# EAGLE schematic arduinoISP (EAGLE 9.1.2)
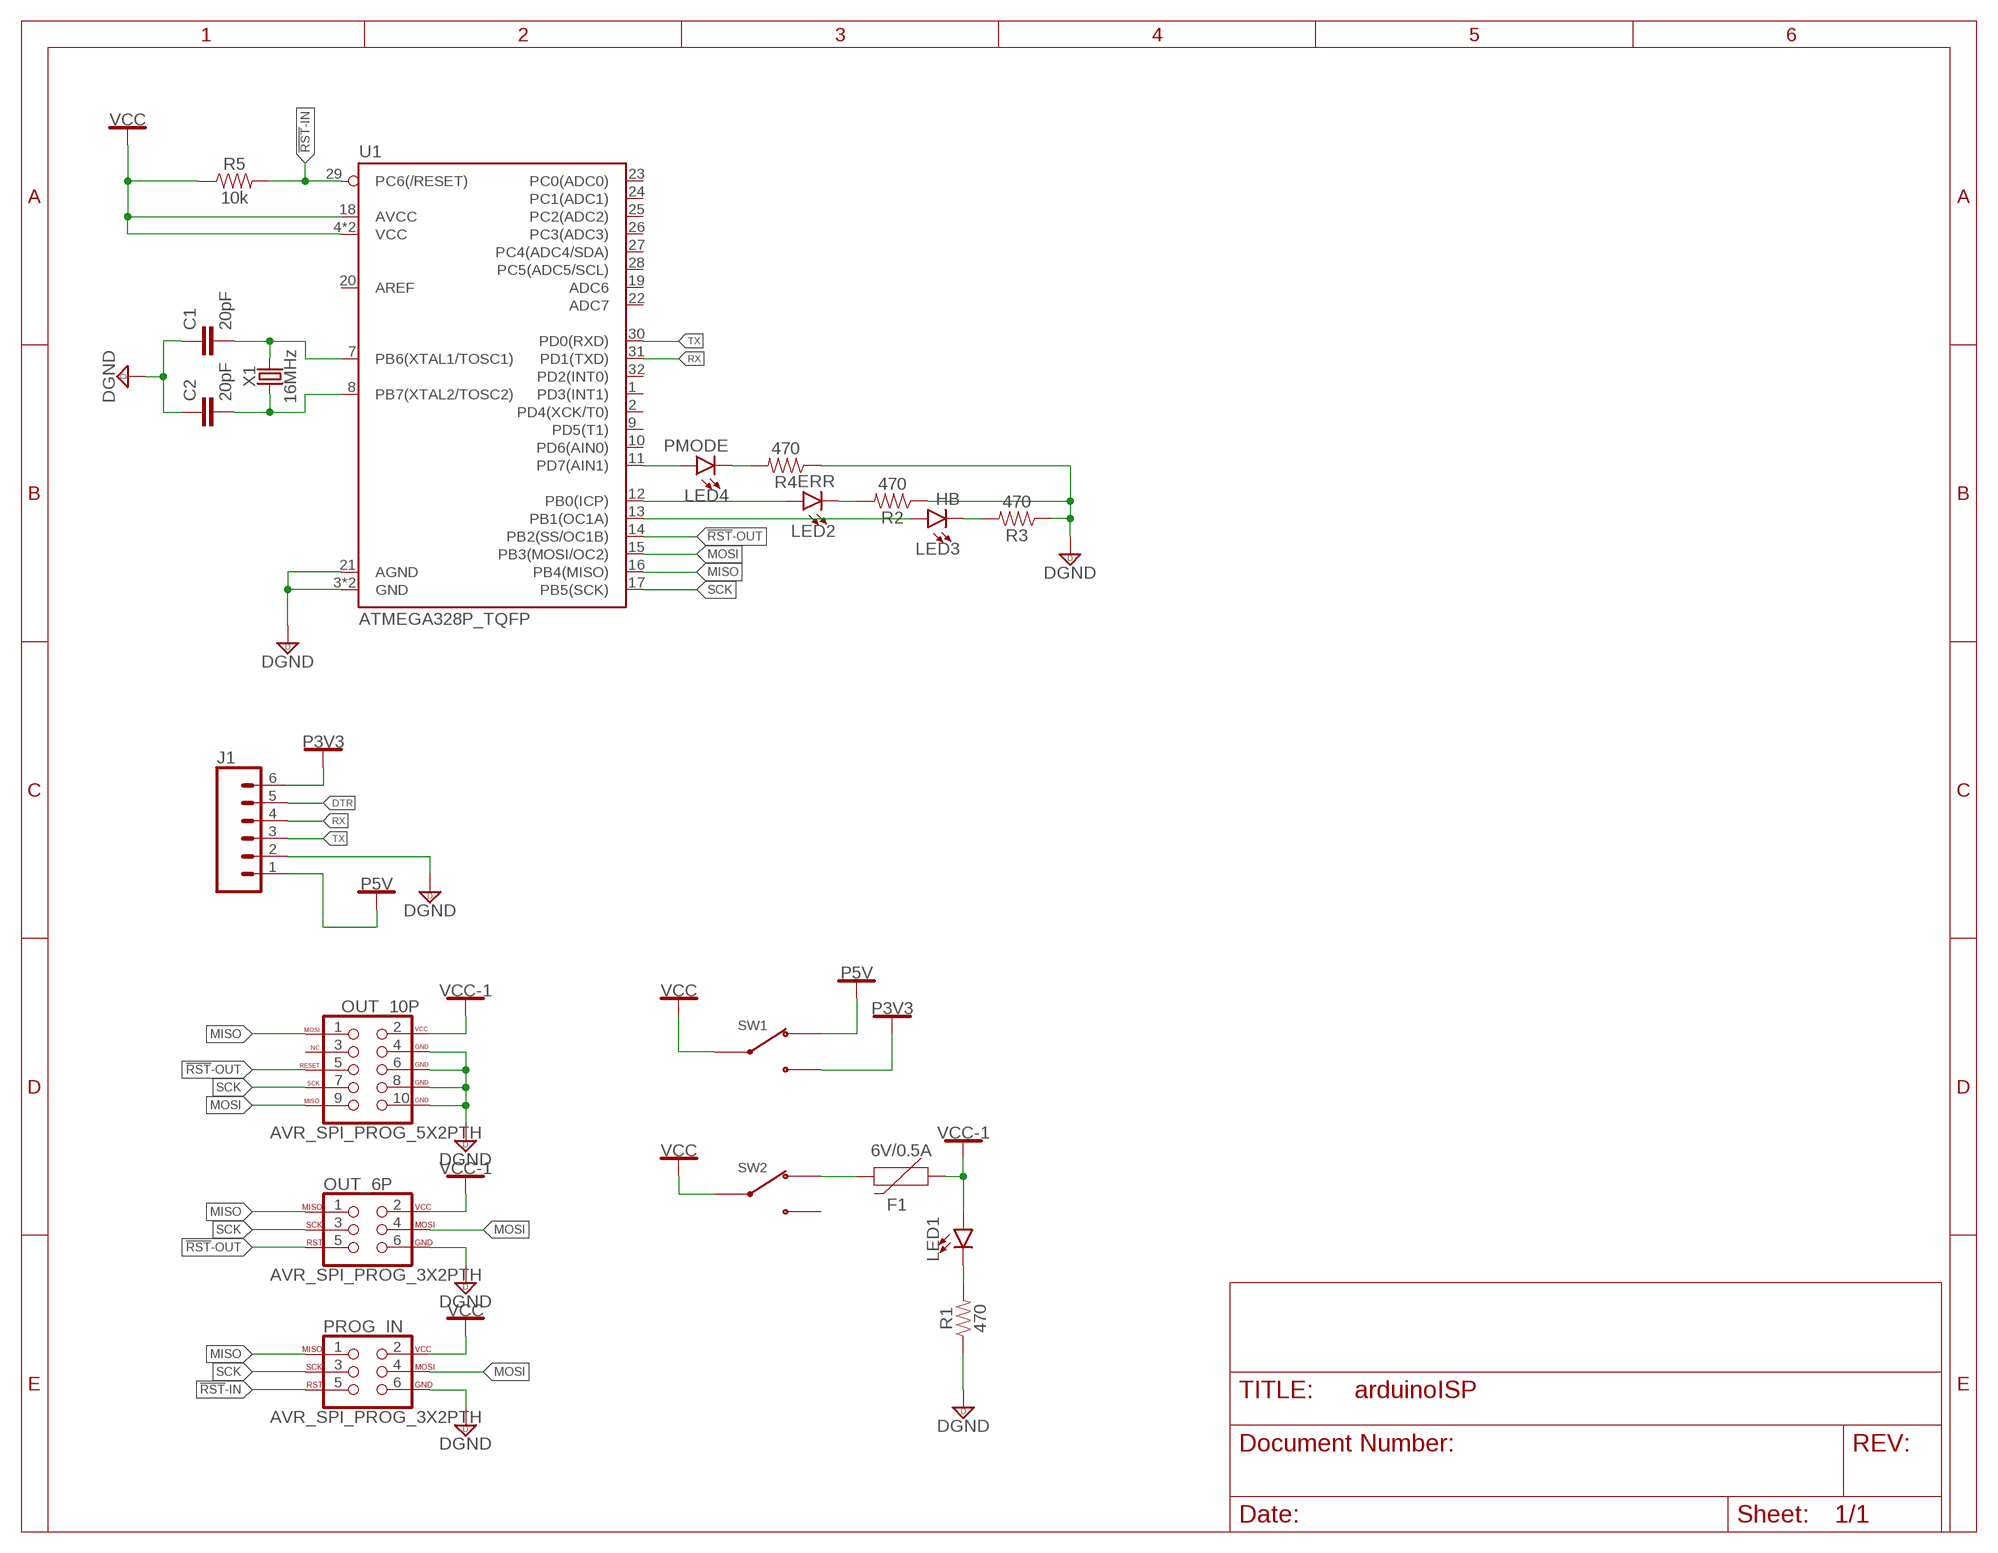
[diagram p0: schematic, sheet 1]

## Parts
C1  20pF  CAPACITOR_SMT_0603  [0603]
C2  20pF  CAPACITOR_SMT_0603  [0603]
F1  6V/0.5A  PPTC_HALF-AMP  [1206]
J1  CONN_06NO_SILK_NO_POP  [1X06_NO_SILK]
LED1  LED3MM  [LED_3MM]
LED2  ERR  LED3MM  [LED_3MM]
LED3  HB  LED3MM  [LED_3MM]
LED4  PMODE  LED3MM  [LED_3MM]
OUT_6P  AVR_SPI_PROG_3X2PTH  [2X3]
OUT_10P  AVR_SPI_PROG_5X2PTH  [2X5]
PROG_IN  AVR_SPI_PROG_3X2PTH  [2X3]
R1  470  RESISTOR_SMT_0603  [0603]
R2  470  RESISTOR_SMT_0603  [0603]
R3  470  RESISTOR_SMT_0603  [0603]
R4  470  RESISTOR_SMT_0603  [0603]
R5  10k  RESISTOR_SMT_0603  [0603]
SW1  SW-SPDT_SS-12D02-VG4  [SW_SS-12D10L5_FP]
SW2  SW-SPDT_SS-12D02-VG4  [SW_SS-12D10L5_FP]
U1  ATMEGA328P_TQFP  [TQFP32-08]
X1  16MHz  CRYSTAL-16MHZPTH-HC49US  [HC49US]

## Nets
!RST!-IN: PROG_IN.5 R5.2 U1.29(PC6(/RESET))
!RST!-OUT: OUT_6P.5 OUT_10P.5(RESET) U1.14(PB2(SS/OC1B))
DGND: C1.1 C2.1 J1.2 OUT_6P.6 OUT_10P.4(GND) OUT_10P.6(GND) OUT_10P.8(GND) OUT_10P.10(GND) PROG_IN.6 R1.1 R2.1 R3.1 R4.1 U1.3(GND) U1.5(GND) U1.21(AGND)
DTR: J1.5
MISO: OUT_6P.1 OUT_10P.1(MOSI) PROG_IN.1 U1.16(PB4(MISO))
MOSI: OUT_6P.4 OUT_10P.9(MISO) PROG_IN.4 U1.15(PB3(MOSI/OC2))
N$1: LED1.K(C) R1.2
N$2: LED2.K(C) R2.2
N$3: LED2.A U1.12(PB0(ICP))
N$4: LED3.K(C) R3.2
N$5: LED4.K(C) R4.2
N$6: LED3.A U1.13(PB1(OC1A))
N$7: LED4.A U1.11(PD7(AIN1))
N$8: C1.2 U1.7(PB6(XTAL1/TOSC1)) X1.2
N$9: C2.2 U1.8(PB7(XTAL2/TOSC2)) X1.1
N$10: F1.2 SW2.P$1(A)
P3V3: J1.6 SW1.P$3(B)
P5V: J1.1 SW1.P$1(A)
RX: J1.4 U1.31(PD1(TXD))
SCK: OUT_6P.3 OUT_10P.7(SCK) PROG_IN.3 U1.17(PB5(SCK))
TX: J1.3 U1.30(PD0(RXD))
VCC: PROG_IN.2 R5.1 SW1.P$2(COM) SW2.P$2(COM) U1.4(VCC) U1.6(VCC) U1.18(AVCC)
VCC1: F1.1 LED1.A OUT_6P.2 OUT_10P.2(VCC) ; supply symbol labelled VCC-1
Unconnected: OUT_10P.3(NC) SW2.P$3(B) U1.1(PD3(INT1)) U1.2(PD4(XCK/T0)) U1.9(PD5(T1)) U1.10(PD6(AIN0)) U1.19(ADC6) U1.20(AREF) U1.22(ADC7) U1.23(PC0(ADC0)) U1.24(PC1(ADC1)) U1.25(PC2(ADC2)) U1.26(PC3(ADC3)) U1.27(PC4(ADC4/SDA)) U1.28(PC5(ADC5/SCL)) U1.32(PD2(INT0))

## Library data of the parts
C1 C2 = myLib-Passive:CAPACITOR_SMT_0603
F1 = SparkFun-Fuses:PPTC: Resettable Fuse PPTC Resettable Fuse. Really a sort of resistor with a polymeric positive temperature coefficient whose resistance increases dramatically with an increase in temperature. When heated by the power passing through the resistance rises causing the current to be limited, protecting the circuit. This is achieved by the transition of the polymer from a crystalline to an amorphous state where the conductive carbon separates breaking the conductive pathways found in the cool crystalline structure. When a PPTC cools back down it resumes conducting letting the circuit turn back on. SparkFun Products: SparkFun RedBoard - Programmed with Arduino <https://www.sparkfun.com/products/12757> Pro Micro - 5V/16MHz <https://www.sparkfun.com/products/12640> Arduino Pro 328 - 5V/16MHz <https://www.sparkfun.com/products/10915> MP3 Trigger <https://www.sparkfun.com/products/13720>; PROD_ID: RES-08585
J1 = SparkFun-Connectors:CONN_06: Multi connection point. Often used as Generic Header-pin footprint for 0.1 inch spaced/style header connections On any of the 0.1 inch spaced packages, you can populate with these: Break Away Headers - Straight <https://www.sparkfun.com/products/116> (PRT-00116) Break Away Male Headers - Right Angle <https://www.sparkfun.com/products/553> (PRT-00553) Female Headers <https://www.sparkfun.com/products/115> (PRT-00115) Break Away Headers - Machine Pin <https://www.sparkfun.com/products/117> (PRT-00117) Break Away Female Headers - Swiss Machine Pin <https://www.sparkfun.com/products/743> (PRT-00743) Arduino Stackable Header - 6 Pin <https://www.sparkfun.com/products/9280> (PRT-09280) For SCREWTERMINALS and SPRING TERMINALS visit here: Screw Terimnals on SparkFun.com <https://www.sparkfun.com/search/results?term=Screw+Terminals> (5mm/3.5mm/2.54mm spacing) This device is also useful as a general connection point to wire up your design to another part of your project. Our various solder wires solder well into these plated through hole pads. Hook-Up Wire - Assortment (Stranded, 22 AWG) <https://www.sparkfun.com/products/11375> (PRT-11375) Hook-Up Wire - Assortment (Solid Core, 22 AWG) <https://www.sparkfun.com/products/11367> (PRT-11367) View the entire wire category on our website here <https://www.sparkfun.com/categories/141>
LED1-LED4 = SparkFun-LED:LED: LED (Generic) Standard schematic elements and footprints for 5mm, 3mm, 1206, and 0603 sized LEDs. Generic LEDs with no color specified.; PROD_ID: DIO-08794
OUT_6P PROG_IN = SparkFun-Connectors:AVR_SPI_PROG_3X2: AVR ISP 6 Pin This is the reduced ISP connector for AVR programming. Common on Arduino. This footprint will take up less PCB space and can be used with a 10-pin to 6-pin adapter such as SKU: BOB-08508 **Special note about "TEST_POINT" package. The stop mask is on the top side, so if you want your programming test points to be on the bottom of your board, make sure to place this package on the bottom side of the board. This also ensure that the orientation to program from the bottom side will be correct. SparkFun Products: SparkFun ISP Pogo Adapter <https://www.sparkfun.com/products/11591> - NS Tiny AVR Programmer <https://www.sparkfun.com/products/11801> -PTH
OUT_10P = SparkFun-Connectors:AVR_SPI_PROG_5X2: AVR 10-pin ICSP Header This is the standard AVR In Circuit Serial Programming header. Minimal, but includes pin one indicator. Works with standard Olimex programmers. SparkFun Products: 2x5 AVR ICSP Male Header <https://www.sparkfun.com/products/778> - PTH 2x5 Pin Shrouded Header <https://www.sparkfun.com/products/8506> - PTH2
R1-R5 = myLib-Passive:RESISTOR_SMT_0603
SW1 SW2 = myLib-SwitchesAndRelays:SW-SPDT_SS-12D02-VG4
U1 = SparkFun-IC-Microcontroller:ATMEGA328P_TQFP: Popular 328P in QFP Storefront component: ATmega328 - TQFP <https://www.sparkfun.com/products/13448> (COM-13448) Datasheet <http://www.sparkfun.com/datasheets/Components/SMD/ATMega328.pdf> SparkFun Products SparkFun RedBoard - Programmed with Arduino <https://www.sparkfun.com/products/12757> (DEV-12757) Arduino Pro Mini 328 - 5V/16MHz <https://www.sparkfun.com/products/11113> (DEV-11113) Arduino Pro Mini 328 - 3.3V/8MHz <https://www.sparkfun.com/products/11114> (DEV-11114) SparkFun OpenLog <https://www.sparkfun.com/products/13712> (DEV-13712) SparkFun MicroView - OLED Arduino Module <https://www.sparkfun.com/products/12923> (DEV-12923) SparkFun Digital Sandbox <https://www.sparkfun.com/products/12651> (DEV-12651) SparkFun PicoBoard <https://www.sparkfun.com/products/11888> (WIG-11888) Arduino Fio <https://www.sparkfun.com/products/10116> (DEV-10116) LilyPad Arduino 328 Main Board <https://www.sparkfun.com/products/13342> (DEV-13342) SparkFun RedStick <https://www.sparkfun.com/products/13741> (DEV-13741) LilyPad MP3 <https://www.sparkfun.com/products/11013> (DEV-11013) LilyPad Arduino SimpleSnap <https://www.sparkfun.com/products/10941> (DEV-10941) SparkFun Stepoko <https://www.sparkfun.com/products/13899> (ROB-13899) SparkFun Geiger Counter <https://www.sparkfun.com/products/11345> (SEN-11345) SparkFun EL Sequencer <https://www.sparkfun.com/products/12781> (COM-12781) Arduino Pro 328 - 5V/16MHz <https://www.sparkfun.com/products/10915> (DEV-10915) CryptoCape <https://www.sparkfun.com/products/12773> (DEV-12773) SparkFun IR Thermometer Evaluation Board - MLX90614 <https://www.sparkfun.com/products/10740> (SEN-10740) SparkFun RedBot Mainboard <https://www.sparkfun.com/products/12097> (ROB-12097) Arduino Pro 328 - 3.3V/8MHz <https://www.sparkfun.com/products/10914> (DEV-10914) SparkFun Block for Intel® Edison - Arduino <https://www.sparkfun.com/products/13036> (DEV-13036) SparkFun Simon Says - Surface Mount Soldering Kit <https://www.sparkfun.com/products/10935> (KIT-10935) SparkFun 7-Segment Serial Display - Red <https://www.sparkfun.com/products/11441> (COM-11441) SparkFun 7-Segment Serial Display - White <https://www.sparkfun.com/products/11629> (COM-11629) SparkFun 7-Segment Serial Display - Yellow <https://www.sparkfun.com/products/11443> (COM-11443) SparkFun 7-Segment Serial Display - Kelly Green <https://www.sparkfun.com/products/11440> (COM-11440) SparkFun 7-Segment Serial Display - Blue <https://www.sparkfun.com/products/11442> (COM-11442) SparkFun OpenSegment Serial Display - 20mm (Blue) <https://www.sparkfun.com/products/11647> (COM-11647) SparkFun OpenSegment Serial Display - 20mm (Green) <https://www.sparkfun.com/products/11646> (COM-11646) SparkFun OpenSegment Serial Display - 20mm (White) <https://www.sparkfun.com/products/11648> (COM-11648) SparkFun OpenSegment Serial Display - 20mm (Red) <https://www.sparkfun.com/products/11644> (COM-11644) SparkFun OpenSegment Serial Display - 20mm (Yellow) <https://www.sparkfun.com/products/11645> (COM-11645) SparkFun OpenSegment Shield <https://www.sparkfun.com/products/13190> (DEV-13190); PROD_ID: IC-09069
X1 = SparkFun-Clocks:CRYSTAL-16MHZ: 16MHz Crystal Digikey Example <http://www.digikey.com/product-search/en?keywords=535-9122-1-ND> Frequency: 16MHz Frequency Stability: ±50ppm Frequency Tolerance: ±20ppm Load Capacitance: 18pF SparkFun Products: Pro Micro -5V/16MHz <https://www.sparkfun.com/products/12640> SparkFun Serial Enabled LCD Kit <https://www.sparkfun.com/products/10097>; PROD_ID: XTAL-08181; SF_ID: COM-00536